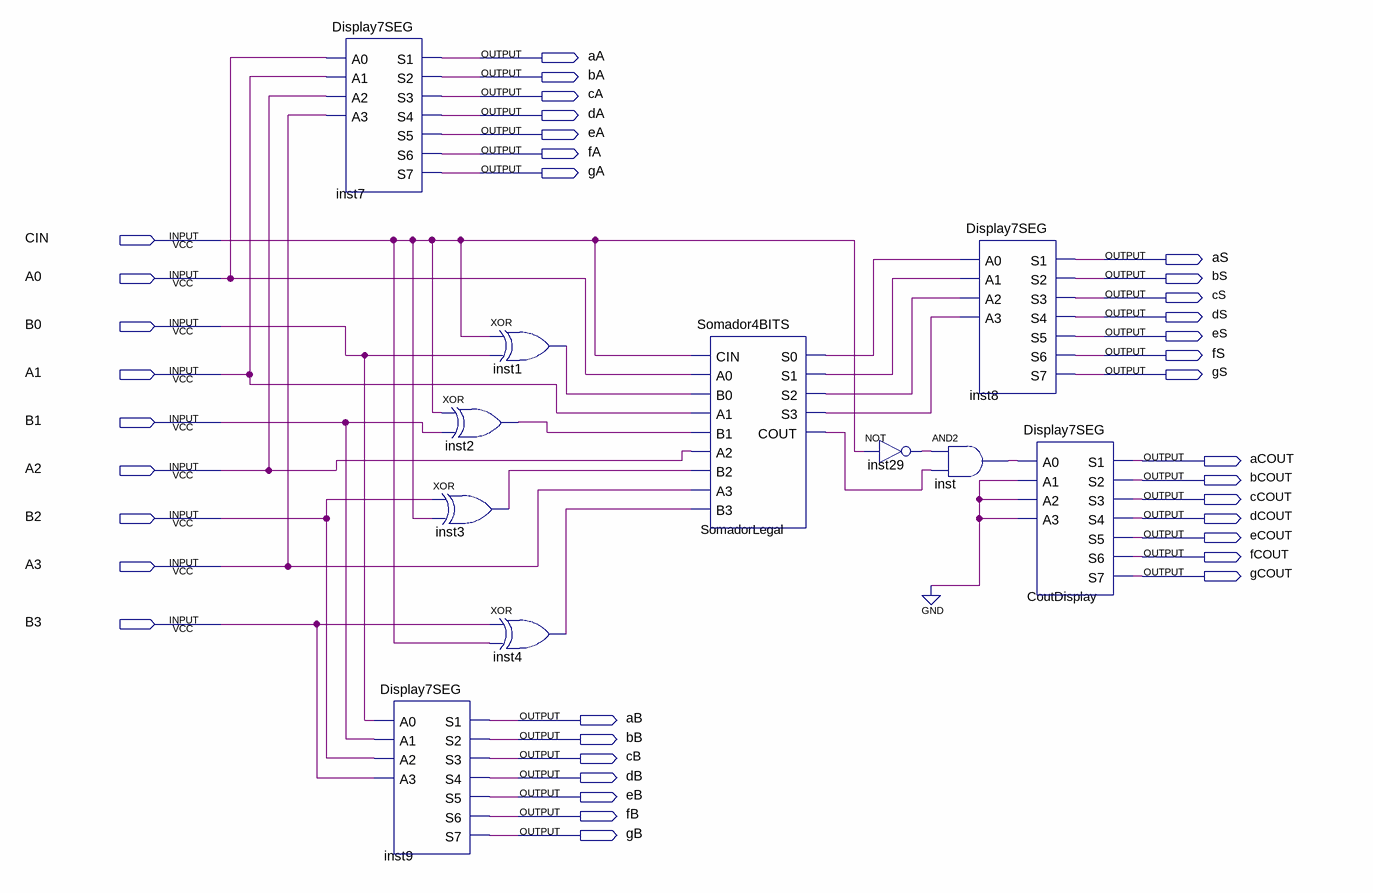
[diagram p0: schematic sheet]
// Quartus schematic ConversorHEX7SEG.bdf as structural Verilog: 11 symbols, 37 pins
module ConversorHEX7SEG (
  input  CIN,
  input  A0,
  input  B0,
  input  A1,
  input  B1,
  input  A2,
  input  B2,
  input  A3,
  input  B3,
  output aA,
  output bA,
  output cA,
  output dA,
  output eA,
  output fA,
  output gA,
  output aS,
  output bS,
  output cS,
  output dS,
  output eS,
  output fS,
  output gS,
  output aCOUT,
  output bCOUT,
  output cCOUT,
  output dCOUT,
  output eCOUT,
  output fCOUT,
  output gCOUT,
  output aB,
  output bB,
  output cB,
  output dB,
  output eB,
  output fB,
  output gB
);

  wire inst1_out, inst2_out, inst3_out, inst4_out, inst29_out, inst_out, SomadorLegal_cout, SomadorLegal_s0,
       SomadorLegal_s1, SomadorLegal_s2, SomadorLegal_s3;

  Display7SEG inst7 (.A0(A0), .A1(A1), .A2(A2), .A3(A3), .S1(aA), .S2(bA), .S3(cA), .S4(dA), .S5(eA), .S6(fA), .S7(gA));
  xor inst3 (inst3_out, B2, CIN);
  Display7SEG inst9 (.A0(B0), .A1(B1), .A2(B2), .A3(B3), .S1(aB), .S2(bB), .S3(cB), .S4(dB), .S5(eB), .S6(fB), .S7(gB));
  xor inst1 (inst1_out, CIN, B0);
  xor inst2 (inst2_out, CIN, B1);
  xor inst4 (inst4_out, B3, CIN);
  Somador4BITS SomadorLegal (
    .CIN(CIN), .A0(A0), .B0(inst1_out), .A1(A1), .B1(inst2_out), .A2(A2), .B2(inst3_out), .A3(A3),
    .B3(inst4_out), .S0(SomadorLegal_s0), .S1(SomadorLegal_s1), .S2(SomadorLegal_s2), .S3(SomadorLegal_s3),
    .COUT(SomadorLegal_cout));
  not inst29 (inst29_out, CIN);
  Display7SEG inst8 (
    .A0(SomadorLegal_s0), .A1(SomadorLegal_s1), .A2(SomadorLegal_s2), .A3(SomadorLegal_s3), .S1(aS), .S2(bS),
    .S3(cS), .S4(dS), .S5(eS), .S6(fS), .S7(gS));
  and inst (inst_out, inst29_out, SomadorLegal_cout);
  Display7SEG CoutDisplay (
    .A0(inst_out), .A1(1'b0), .A2(1'b0), .A3(1'b0), .S1(aCOUT), .S2(bCOUT), .S3(cCOUT), .S4(dCOUT),
    .S5(eCOUT), .S6(fCOUT), .S7(gCOUT));
endmodule
